# EAGLE design MMIC LNA (EAGLE 7.1.0)
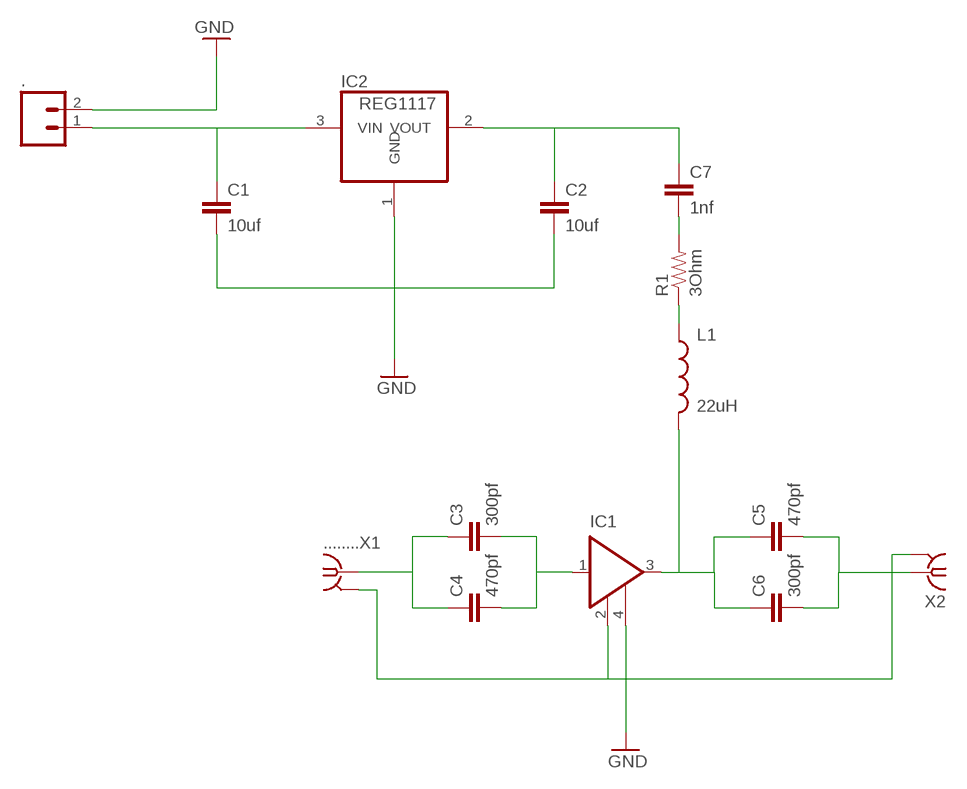
[diagram p0: schematic, sheet 1]

## Parts
.  M02LOCK_LONGPADS  [1X02_LOCK_LONGPADS]
........X1  BU-SMA-V  [BU-SMA-V]
C1  10uf  CAP0603-CAP  [0603-CAP]
C2  10uf  CAP0603-CAP  [0603-CAP]
C3  300pf  CAP0603-CAP  [0603-CAP]
C4  470pf  CAP0603-CAP  [0603-CAP]
C5  470pf  CAP0603-CAP  [0603-CAP]
C6  300pf  CAP0603-CAP  [0603-CAP]
C7  1nf  CAP0603-CAP  [0603-CAP]
IC1  ERA-3SM  [WW]
IC2  REG1117  [SOT223]
L1  22uH  INDUCTOR0603  [0603]
R1  3Ohm  RESISTOR0603-RES  [0603-RES]
X2  BU-SMA-V  [BU-SMA-V]

## Nets
GND: ..2 ........X1.2 ........X1.3 ........X1.4 ........X1.5 C1.2 C2.2 IC1.2(GND) IC1.4(GND) IC2.1(GND) X2.2 X2.3 X2.4 X2.5
N$1: ..1 C1.1 IC2.3(VIN)
N$2: C5.1 C6.1 IC1.3(RFOUT/DCIN) L1.2
N$3: C2.1 C7.1 IC2.2(VOUT)
N$4: C7.2 R1.2
N$5: L1.1 R1.1
N$6: C5.2 C6.2 X2.1
N$7: C3.2 C4.2 IC1.1(RFIN)
N$8: ........X1.1 C3.1 C4.1

## Library data of the parts
. = SparkFun-Connectors:M02: Standard 2-pin 0.1" header. Use with - straight break away headers ( PRT-00116) - right angle break away headers (PRT-00553) - swiss pins (PRT-00743) - machine pins (PRT-00117) - female headers (PRT-00115) Molex polarized connector foot print use with: PRT-08233 with associated crimp pins and housings. 2.54_SCREWTERM for use with PRT-10571. 3.5mm Screw Terminal footprints for PRT-08084 5mm Screw Terminal footprints for use with PRT-08432
........X1 X2 = con-coax:BU-SMA-V: FEMALE SMA CONNECTOR Radiall distributor RS 112-3794; OC_FARNELL: unknown; OC_NEWARK: unknown
C1-C7 = SparkFun-Capacitors:CAP: Capacitor Standard 0603 ceramic capacitor, and 0.1" leaded capacitor.
IC1 = linear:ERA-*: MONOLITHIC AMPLIFIERS 50 Ohm BROADBAND DC to 8 GHz Source: Datasheet <http://www.mini-circuits.com/pdfs/ERA-3SM+.pdf>
IC2 = burr-brown:REG1117: 800mA and 1A Low Dropout (LDO) Positive Regulator 1.8V, 2.5V, 2.85V, 3.3V, 5V, and Adj; MPN: REG1117; OC_FARNELL: 1097566; OC_NEWARK: 14P6981
L1 = SparkFun-Passives:INDUCTOR: Inductors Basic Inductor/Choke - 0603 and 1206. Footprints are not proven and vary greatly between part numbers. SRN6045- 33uH, 20% 1.4A SDR0403-560KL - 56uH, 10%, 500mA RMS/740mA peak
R1 = SparkFun-Passives:RESISTOR: Resistor Basic schematic elements and footprints for 0603, 1206, and PTH resistors.

## Board
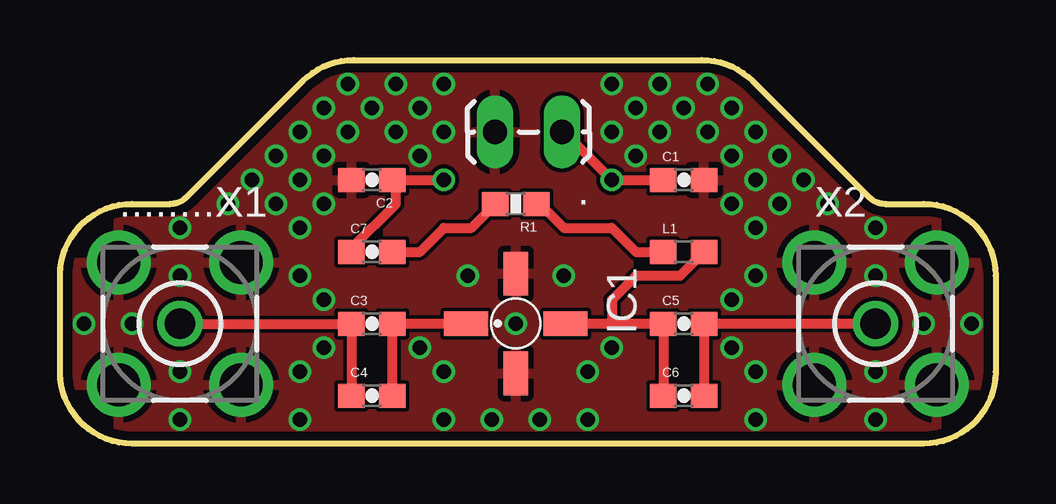
[diagram p1: board, top side]
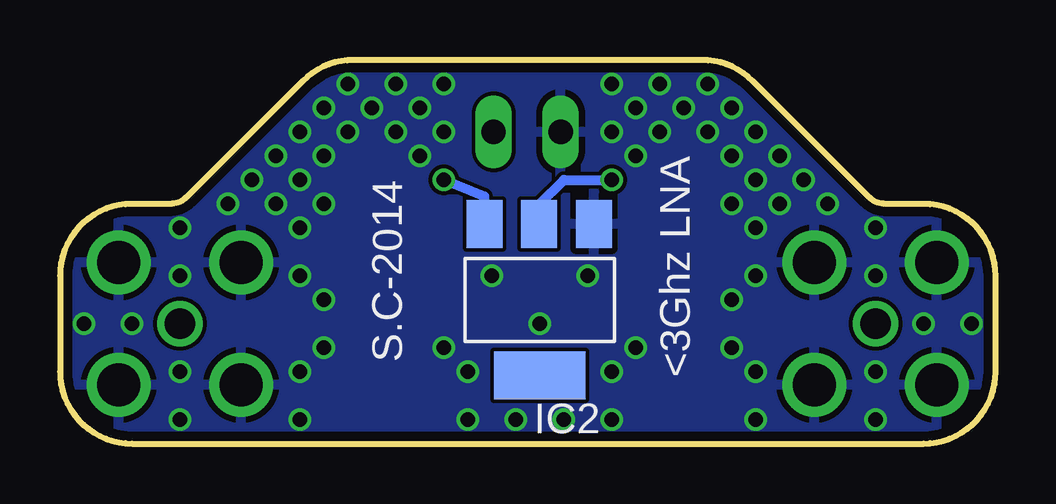
[diagram p2: board, bottom side, seen from below]

Size 39 x 16 mm. Coordinates in mm from the lower left corner, seen from the top.
Outline: 28.88,15.12 33.71,10.29 arc45 34.41,10 36,10 arc-90 39,7 39,3 arc-90 36,0 3,0 arc-90 0,3 0,7 arc-90 3,10 4.59,10 arc45 5.29,10.29 10.12,15.12 arc-45 12.24,16 26.76,16 arc-45 28.88,15.12
Copper layers (1*16): Top 0.0356mm / dielectric 1.5011mm / Bottom 0.0356mm
Design rules "LaenPCBOrder": minimum track width 6mil, minimum drill 13mil, track to track 6mil, track to pad 6mil, pad to pad 6mil, via to via 6mil, smd to smd 6mil, copper to edge 15mil, drill to drill 6mil, minimum pad ring 7mil, minimum via ring 7mil, stop-mask expansion 3mil, vias tented up to drill 0mil, thermal gap 10mil

### Footprints (pad centres in the part's own frame; a part is rotated, then mirrored left to right if it is on the bottom)
1X02_LOCK_LONGPADS = drill 1.016 long: 1 -0.127,0; 2 2.667,0
BU-SMA-V = drill 1.27: 1 0,0 | drill 1.778: 2 -2.55,2.55; 3 2.55,2.55; 4 2.55,-2.55; 5 -2.55,-2.55
0603-CAP = smd 1.1 x 1: 1 -0.85,0; 2 0.85,0
WW = smd 1.02 x 1.83: 1 0,-2.075; 3 0,2.075 | smd 1.83 x 1.02: 2 2.075,0; 4 -2.075,0
SOT223 = smd 1.499 x 2.007: 1 -2.261,-3.15; 2 0.025,-3.15; 3 2.311,-3.15 | smd 3.81 x 2.007: 4 0,3.15
0603 = smd 1.1 x 1: 1 -0.85,0; 2 0.85,0
0603-RES = smd 1.1 x 1: 1 -0.85,0; 2 0.85,0

### Placement (x,y rotation side)
.  20.8,13 180 top
........X1  5,5 0 top
C1  26,11 0 top
C2  13,11 180 top
C3  13,5 0 top
C4  13,2 0 top
C5  26,5 0 top
C6  26,2 0 top
C7  13,8 0 top
IC1  19,5.01 270 top
IC2  19,6 180 bottom
L1  26,8 0 top
R1  19,10 180 top
X2  34,5 0 top

### Tracks (layer width: path | path; a pad name or v marks a point on that pad's centre or on a via)
GND  (via drill 0.6)
  other vias: 8,11 10,11 10,13 10,9 10,7 10,3 16,3 22,3 29,3 29,7 29,9 29,11 29,13 31,11 17,7 21,7 5,3 3,5 5,7 34,3 34,9 36,5 12,13 14,13 25,13 27,13 11,14 13,14 15,14 9,12 11,12 11,10 9,10 11,4 10,1 24,14 26,14 28,14 28,12 30,12 30,10 28,10 19,5 28,4 29,1 15,4 23,4 22,1 16,1 20,1 18,1 32,10 7,10 16,15 14,15 12,15 23,15 25,15 27,15 34,7 38,5 34,1 5,9 1,5 5,1 16,13 23,13 24,12 15,12 11,6 28,6
  pour Bottom: 0,0 0,10 5,10 11,16 28,16 34,10 39,10 39,0
  pour Top: 0,0 0,10 5,10 11,16 28,16 34,10 39,10 39,0
N$1  (via drill 0.6)
  Top 0.406: ..1 20.83,13.17 v23,11 C1.1
  Bottom 0.406: IC2.3 21.31,10.31 v23,11
N$2
  Top 0.406: C6.1 C5.1 23,5.01 | IC1.3 23,5.01 | L1.2 25.85,7 24,7 23,6 23,5.01
N$3  (via drill 0.6)
  Top 0.406: v16,11 C2.1 14,10.85 14,10 12.15,8.15 C7.1
  Bottom 0.406: IC2.2 19.02,9.97 18,11 v16,11
N$4
  Top 0.406: C7.2 15,8 16,9 17.15,9 R1.2
N$5
  Top 0.406: R1.1 20,10 21,9 23,9 24,8 L1.1
N$6
  Top 0.406: C6.2 C5.2 X2.1
N$7
  Top 0.406: C4.2 C3.2 17.27,5 IC1.1
N$8
  Top 0.406: C4.1 C3.1 ........X1.1

### Text on the board
bNames: <3Ghz LNA | S.C-2014